# EAGLE design UsbThumb_v1 (EAGLE 5.07)
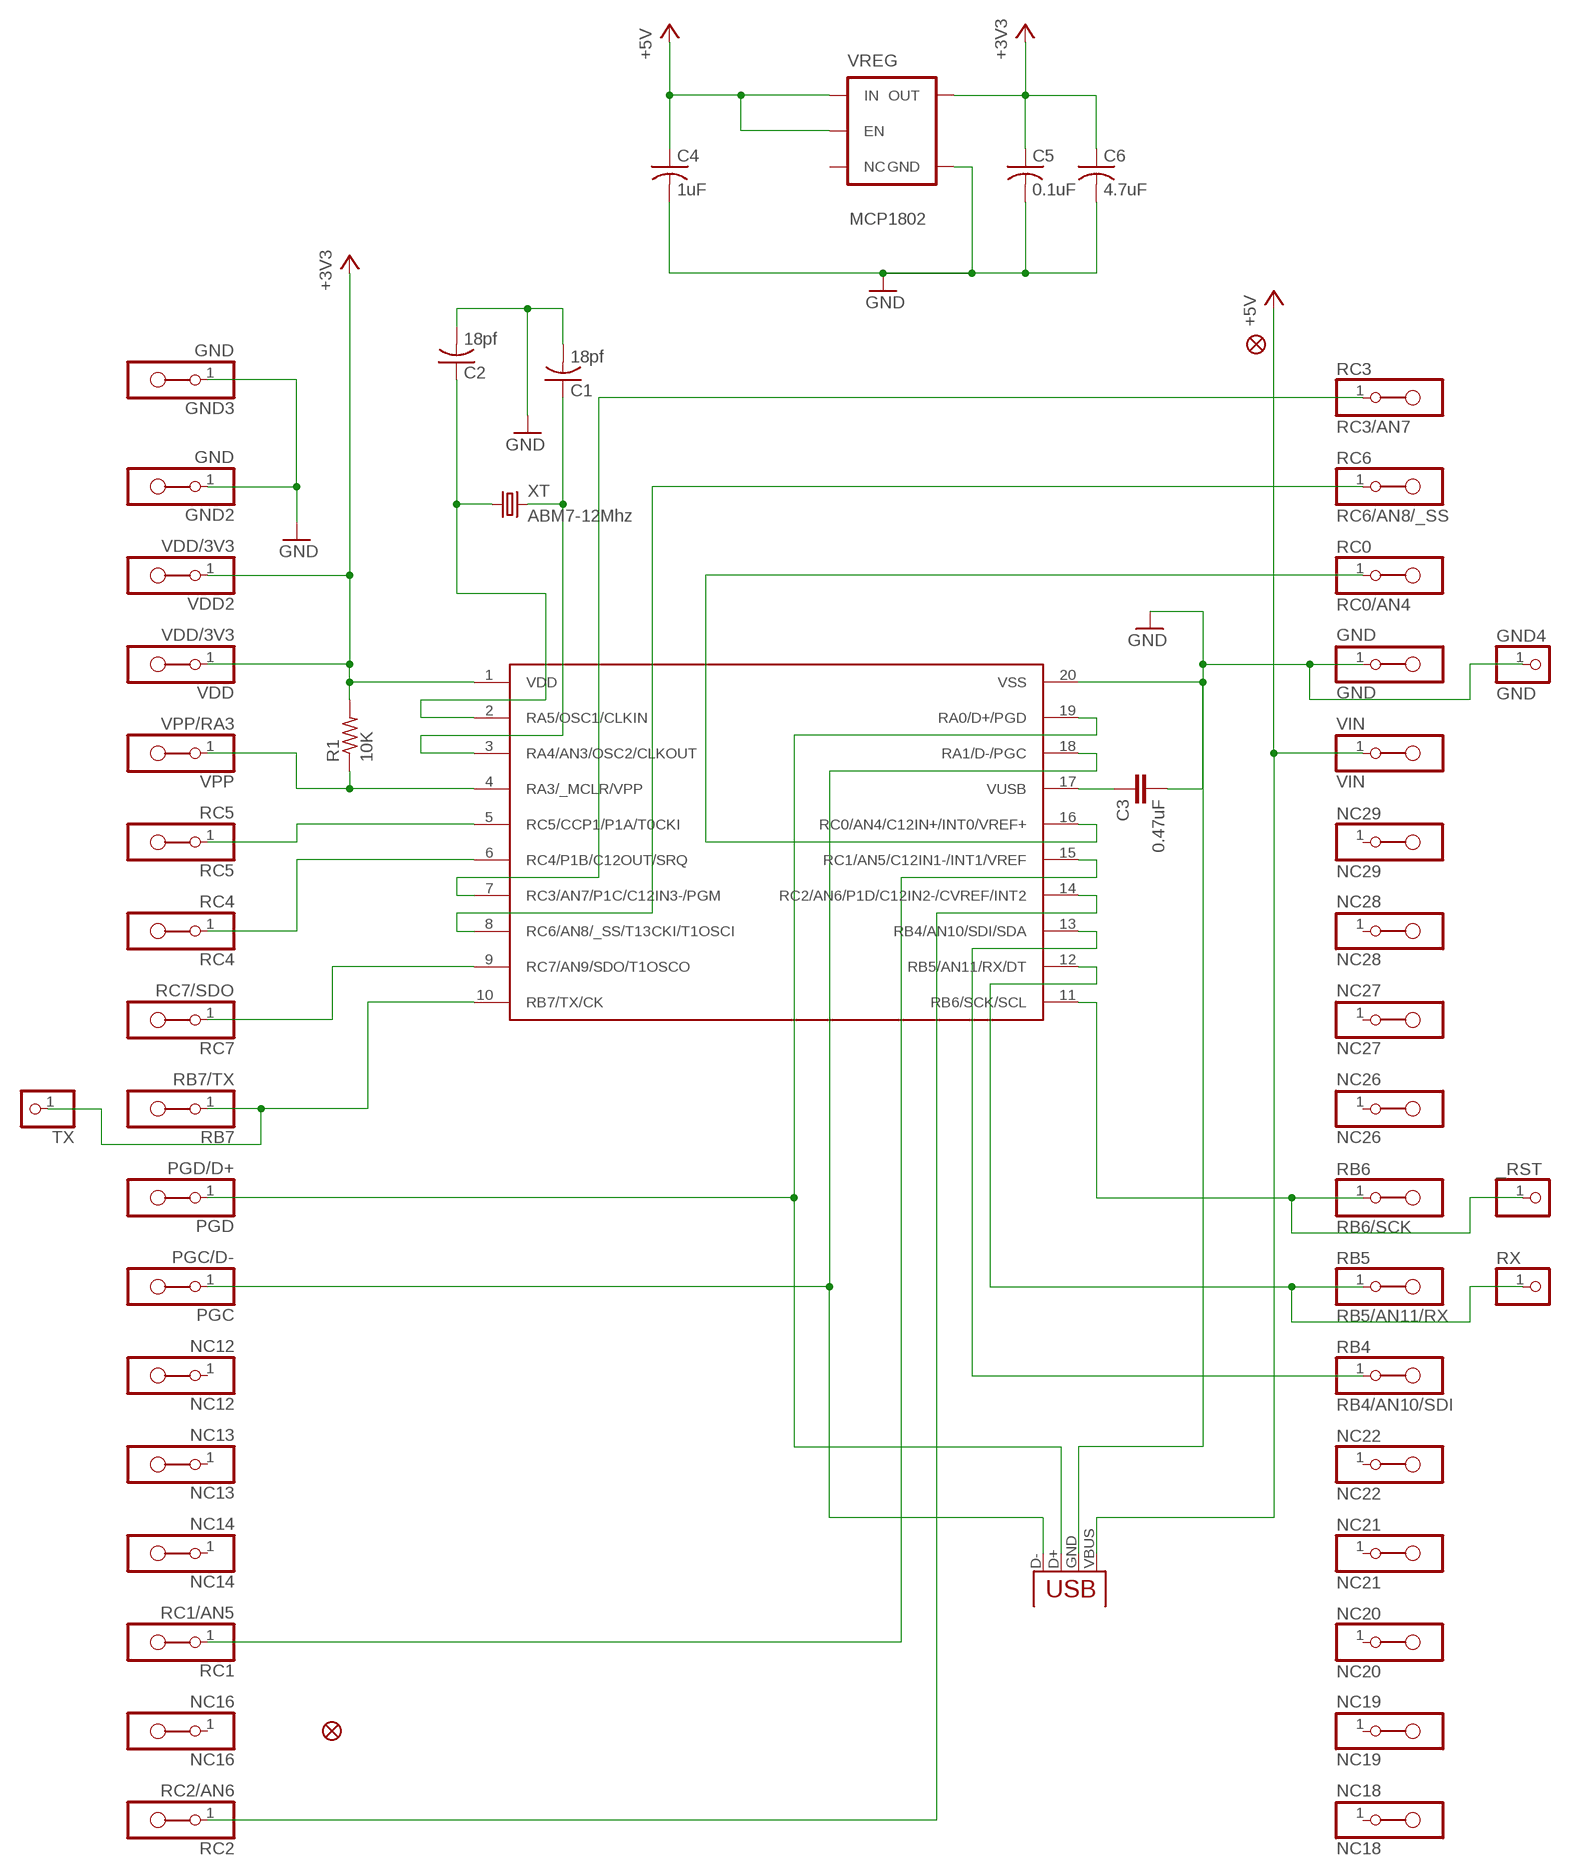
[diagram p0: schematic, sheet 1]

## Parts
_RST  PINHD-1X1  [1X01]
C1  18pf  C-USC0805  [C0805]
C2  18pf  C-USC0805  [C0805]
C3  0.47uF  C-EUC0805  [C0805]
C4  1uF  C-USC0805  [C0805]
C5  0.1uF  C-USC0805  [C0805]
C6  4.7uF  C-USC3216  [C3216]
F1  FIDUCIAL  [FIDUCIAL_1_3]
F2  FIDUCIAL  [FIDUCIAL_1_3]
GND  GND  PINHD-DOUBLECUSTOM1  [PINHD-DOUBLE-CUSTOM1]
GND2  GND  PINHD-DOUBLECUSTOM2  [PINHD-DOUBLE-CUSTOM2]
GND3  GND  PINHD-DOUBLECUSTOM2  [PINHD-DOUBLE-CUSTOM2]
GND4  GND  PINHD-1X1  [1X01]
NC12  NC12  PINHD-DOUBLECUSTOM2  [PINHD-DOUBLE-CUSTOM2]
NC13  NC13  PINHD-DOUBLECUSTOM2  [PINHD-DOUBLE-CUSTOM2]
NC14  NC14  PINHD-DOUBLECUSTOM2  [PINHD-DOUBLE-CUSTOM2]
NC16  NC16  PINHD-DOUBLECUSTOM2  [PINHD-DOUBLE-CUSTOM2]
NC18  NC18  PINHD-DOUBLECUSTOM1  [PINHD-DOUBLE-CUSTOM1]
NC19  NC19  PINHD-DOUBLECUSTOM1  [PINHD-DOUBLE-CUSTOM1]
NC20  NC20  PINHD-DOUBLECUSTOM1  [PINHD-DOUBLE-CUSTOM1]
NC21  NC21  PINHD-DOUBLECUSTOM1  [PINHD-DOUBLE-CUSTOM1]
NC22  NC22  PINHD-DOUBLECUSTOM1  [PINHD-DOUBLE-CUSTOM1]
NC26  NC26  PINHD-DOUBLECUSTOM1  [PINHD-DOUBLE-CUSTOM1]
NC27  NC27  PINHD-DOUBLECUSTOM1  [PINHD-DOUBLE-CUSTOM1]
NC28  NC28  PINHD-DOUBLECUSTOM1  [PINHD-DOUBLE-CUSTOM1]
NC29  NC29  PINHD-DOUBLECUSTOM1  [PINHD-DOUBLE-CUSTOM1]
PGC  PGC/D-  PINHD-DOUBLECUSTOM2  [PINHD-DOUBLE-CUSTOM2]
PGD  PGD/D+  PINHD-DOUBLECUSTOM2  [PINHD-DOUBLE-CUSTOM2]
PIC  PIC18XF1XK50  [SO-20W]
R1  10K  R-US_M0805  [M0805]
RB4  RB4/AN10/SDI  PINHD-DOUBLECUSTOM1  [PINHD-DOUBLE-CUSTOM1]
RB5  RB5/AN11/RX  PINHD-DOUBLECUSTOM1  [PINHD-DOUBLE-CUSTOM1]
RB6  RB6/SCK  PINHD-DOUBLECUSTOM1  [PINHD-DOUBLE-CUSTOM1]
RB7  RB7/TX  PINHD-DOUBLECUSTOM2  [PINHD-DOUBLE-CUSTOM2]
RC0  RC0/AN4  PINHD-DOUBLECUSTOM1  [PINHD-DOUBLE-CUSTOM1]
RC1  RC1/AN5  PINHD-DOUBLECUSTOM2  [PINHD-DOUBLE-CUSTOM2]
RC2  RC2/AN6  PINHD-DOUBLECUSTOM2  [PINHD-DOUBLE-CUSTOM2]
RC3  RC3/AN7  PINHD-DOUBLECUSTOM1  [PINHD-DOUBLE-CUSTOM1]
RC4  RC4  PINHD-DOUBLECUSTOM2  [PINHD-DOUBLE-CUSTOM2]
RC5  RC5  PINHD-DOUBLECUSTOM2  [PINHD-DOUBLE-CUSTOM2]
RC6  RC6/AN8/_SS  PINHD-DOUBLECUSTOM1  [PINHD-DOUBLE-CUSTOM1]
RC7  RC7/SDO  PINHD-DOUBLECUSTOM2  [PINHD-DOUBLE-CUSTOM2]
RX  PINHD-1X1  [1X01]
TX  PINHD-1X1  [1X01]
USB-A  USB-A-H  [USB-A-H]
VDD  VDD/3V3  PINHD-DOUBLECUSTOM2  [PINHD-DOUBLE-CUSTOM2]
VDD2  VDD/3V3  PINHD-DOUBLECUSTOM2  [PINHD-DOUBLE-CUSTOM2]
VIN  VIN  PINHD-DOUBLECUSTOM1  [PINHD-DOUBLE-CUSTOM1]
VPP  VPP/RA3  PINHD-DOUBLECUSTOM2  [PINHD-DOUBLE-CUSTOM2]
VREG  MCP1802  V_REG_TPS76433SOT23-5  [SOT23-5]
XT  ABM7-12Mhz  ABM7  [ABM7]

## Nets
+3V3: C5.1 C6.1 PIC.1(VDD) R1.2 VDD2.1 VDD.1 VREG.5(OUT)
+5V: C4.1 USB-A.VBUS(GND) VIN.1 VREG.1(IN) VREG.3(EN)
GND: C1.2 C2.2 C3.2 C4.2 C5.2 C6.2 GND2.1 GND3.1 GND4.1 GND.1 PIC.20(VSS) USB-A.GND(VBUS) VREG.2(GND)
N$1: C1.1 PIC.3(RA4/AN3/OSC2/CLKOUT) XT.2
N$4: PGC.1 PIC.18(RA1/D-/PGC) USB-A.D-(D+)
N$6: PGD.1 PIC.19(RA0/D+/PGD) USB-A.D+(D-)
N$7: PIC.10(RB7/TX/CK) RB7.1 TX.1
N$11: PIC.9(RC7/AN9/SDO/T1OSCO) RC7.1
N$12: C2.1 PIC.2(RA5/OSC1/CLKIN) XT.1
N$13: PIC.6(RC4/P1B/C12OUT/SRQ) RC4.1
N$14: PIC.5(RC5/CCP1/P1A/T0CKI) RC5.1
N$16: C3.1 PIC.17(VUSB)
N$19: PIC.12(RB5/AN11/RX/DT) RB5.1 RX.1
P7: PIC.7(RC3/AN7/P1C/C12IN3-/PGM) RC3.1
P8: PIC.8(RC6/AN8/_SS/T13CKI/T1OSCI) RC6.1
P11: _RST.1 PIC.11(RB6/SCK/SCL) RB6.1
P13: PIC.13(RB4/AN10/SDI/SDA) RB4.1
P14: PIC.14(RC2/AN6/P1D/C12IN2-/CVREF/INT2) RC2.1
P15: PIC.15(RC1/AN5/C12IN1-/INT1/VREF) RC1.1
P16: PIC.16(RC0/AN4/C12IN+/INT0/VREF+) RC0.1
VPP: PIC.4(RA3/_MCLR/VPP) R1.1 VPP.1
Unconnected: NC12.1 NC13.1 NC14.1 NC16.1 NC18.1 NC19.1 NC20.1 NC21.1 NC22.1 NC26.1 NC27.1 NC28.1 NC29.1 VREG.4(NC)

## Library data of the parts
_RST GND4 RX TX = pinhead:PINHD-1X1: PIN HEADER
C1 C2 C4 C5 = resistor:C-US: CAPACITOR, American symbol
C3 = rcl:C-EU: CAPACITOR, European symbol
C6 = rcl:C-US: CAPACITOR, American symbol
F1 F2 = fiducials:FIDUCIAL: Fiducial Alignment Point for machine vision alignment.
GND GND2 GND3 NC12-NC14 NC16 NC18-NC22 NC26-NC29 PGC PGD RB4-RB7 RC0 RC1-RC7 VDD VDD2 VIN VPP = starlino:PINHD-DOUBLE: Pinhead with two connected pads
PIC = microchip-pic18XF1XK50:PIC18XF1XK50: PIC18F13K50/14K50 PIC18LF13K50/14K50
R1 = resistor:R-US_: RESISTOR, American symbol
USB-A = SparkFun:USB: USB Connectors USB-B-PTH is fully proven SKU : PRT-00139 USB-miniB is fully proven SKU : PRT-00587 USB-A-PCB is untested. USB-A-H is throughly reviewed, but untested. Spark Fun Electronics SKU : PRT-00437 USB-B-SMT is throughly reviewed, but untested. Needs silkscreen touching up. USB-A-S has not been used/tested USB-MB-H has not been used/tested
VREG = SparkFun:V_REG_TPS76433: Voltage Regulator Older TI part. LDO 150mA regulator. No output by-pass cap option. See V_REG_LDO for a better part.
XT = crystals-misc:ABM7: ABM7 CERAMIC SMD MICRO MINIATURE MICROPROCESSOR CRYSTAL

## Board
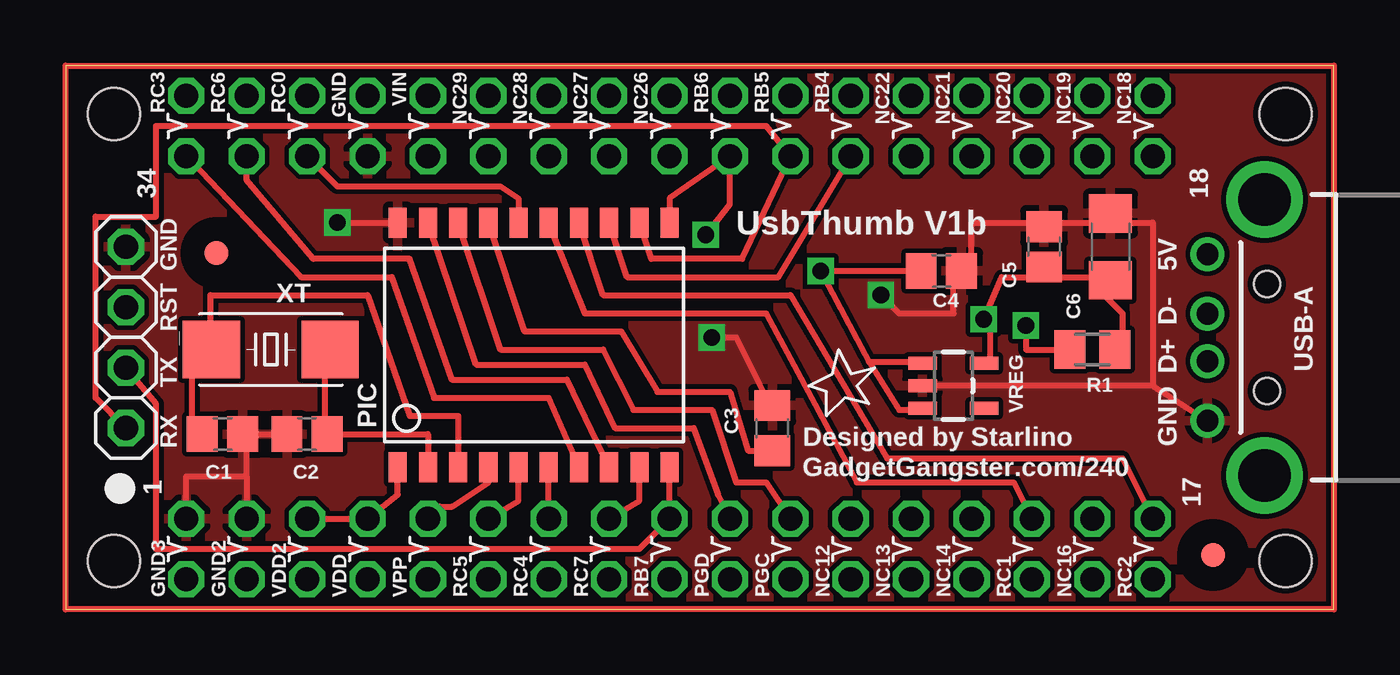
[diagram p1: board, top side]
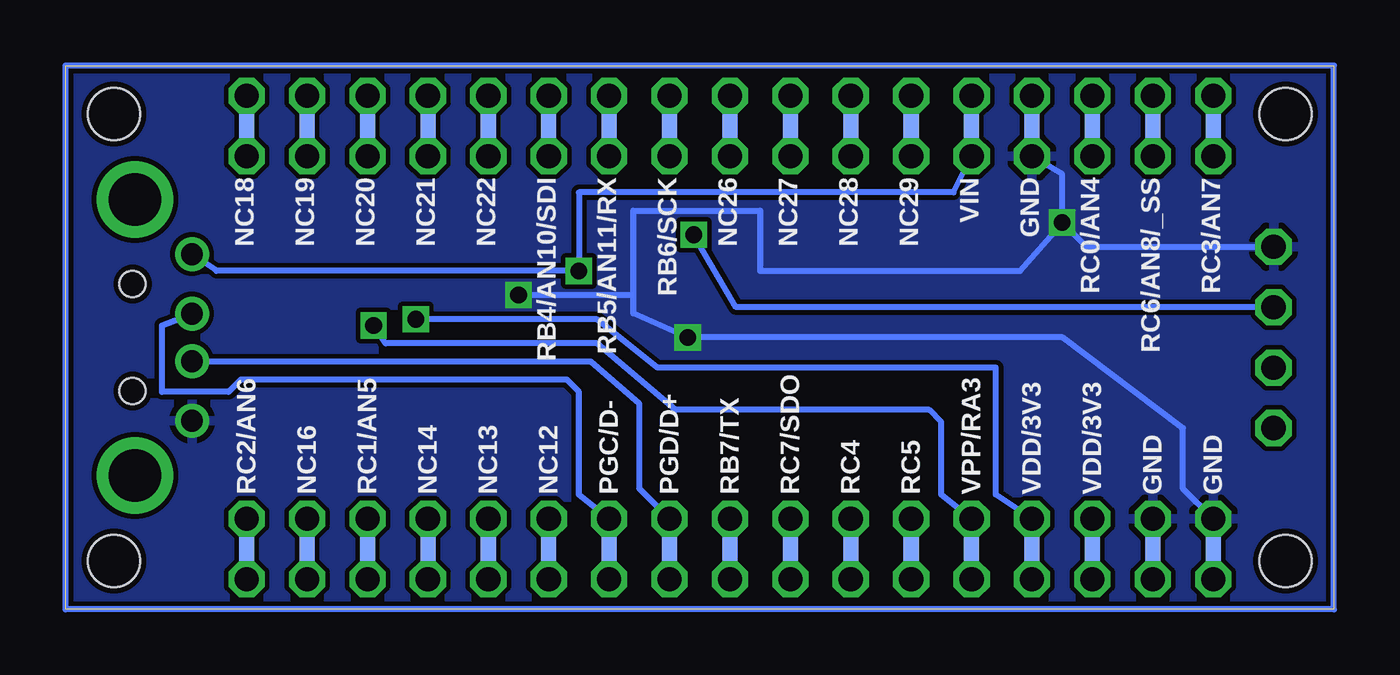
[diagram p2: board, bottom side, seen from below]

Size 53.34 x 22.86 mm. Coordinates in mm from the lower left corner, seen from the top.
Outline: 0,0 53.34,0 53.34,22.86 0,22.86 0,0
Copper layers (1*16): Top 0.035mm / dielectric 1.5mm / Bottom 0.035mm
Design rules "default *": minimum track width 8mil, minimum drill 24mil, track to track 8mil, track to pad 8mil, pad to pad 8mil, via to via 8mil, smd to smd 8mil, copper to edge 10mil, drill to drill 8mil, minimum pad ring 10mil, minimum via ring 8mil, stop-mask expansion 4mil, vias tented up to drill 0mil, thermal gap 10mil
Holes 2.2 mm at 51.31,20.83 51.31,2.03 2.03,20.83 2.03,2.03

### Footprints (pad centres in the part's own frame; a part is rotated, then mirrored left to right if it is on the bottom)
1X01 = drill 1.016 octagon: 1 0,0
C0805 = smd 1.3 x 1.5: 1 -0.85,0; 2 0.85,0
C0805' = smd 1.3 x 1.5: 1 -0.95,0; 2 0.95,0
C3216 = smd 1.6 x 1.8: 1 -1.4,0; 2 1.4,0
FIDUCIAL_1_3 = smd 1 x 1: 1 0,0
PINHD-DOUBLE-CUSTOM1 = drill 1.016 octagon: 1 -1.27,0; 2 1.27,0 | smd 1.27 x 0.635 bottom: P$1 0,0
PINHD-DOUBLE-CUSTOM2 = drill 1.016 octagon: 1 -1.27,0; 2 1.27,0 | smd 1.27 x 0.635 bottom: P$1 0,0
SO-20W = smd 0.762 x 1.27: 1 -5.08,-5.207; 2 -3.81,-5.207; 3 -2.54,-5.207; 4 -1.27,-5.207; 5 0,-5.207; 6 1.27,-5.207; 7 2.54,-5.207; 8 3.81,-5.207; 9 5.08,-5.207; 10 6.35,-5.207; 11 6.35,5.08; 12 5.08,5.08; 13 3.81,5.08; 14 2.54,5.08; 15 1.27,5.08; 16 0,5.08; 17 -1.27,5.08; 18 -2.54,5.08; 19 -3.81,5.08; 20 -5.08,5.08
M0805 = smd 1.3 x 1.6: 1 -0.95,0; 2 0.95,0
USB-A-H = drill 0.914 round: D+ 2.4,1; D- 2.4,-1; GND 2.4,3.5; VBUS 2.4,-3.5 | drill 2.2 round: GND@1 0,5.8; GND@2 0,-5.8 | hole 1.1: -0.1,2.25; -0.1,-2.25
SOT23-5 = smd 0.55 x 1.2: 1 -0.95,-1.3; 2 0,-1.3; 3 0.95,-1.3; 4 0.95,1.3; 5 -0.95,1.3
ABM7 = smd 2.4 x 2.4: 1 -2.5,0; 2 2.5,0

### Placement (x,y rotation side)
_RST  2.54,12.7 0 top
C1  6.6,7.37 0 top
C2  10.16,7.37 180 top
C3  0.47uF  [C0805']  29.72,7.62 90 top
C4  36.83,14.22 0 top
C5  41.15,15.24 90 top
C6  43.94,15.24 90 top
F1  6.35,14.99 0 top
F2  48.26,2.29 0 top
GND  12.7,20.32 90 top
GND2  7.62,2.54 270 top
GND3  5.08,2.54 270 top
GND4  2.54,15.24 0 top
NC12  33.02,2.54 270 top
NC13  35.56,2.54 270 top
NC14  38.1,2.54 270 top
NC16  43.18,2.54 270 top
NC18  45.72,20.32 90 top
NC19  43.18,20.32 90 top
NC20  40.64,20.32 90 top
NC21  38.1,20.32 90 top
NC22  35.56,20.32 90 top
NC26  25.4,20.32 90 top
NC27  22.86,20.32 90 top
NC28  20.32,20.32 90 top
NC29  17.78,20.32 90 top
PGC  30.48,2.54 270 top
PGD  27.94,2.54 270 top
PIC  19.05,11.18 0 top
R1  43.18,10.92 0 top
RB4  33.02,20.32 90 top
RB5  30.48,20.32 90 top
RB6  27.94,20.32 90 top
RB7  25.4,2.54 270 top
RC0  10.16,20.32 90 top
RC1  40.64,2.54 270 top
RC2  45.72,2.54 270 top
RC3  5.08,20.32 90 top
RC4  20.32,2.54 270 top
RC5  17.78,2.54 270 top
RC6  7.62,20.32 90 top
RC7  22.86,2.54 270 top
RX  2.54,7.62 0 top
TX  2.54,10.16 0 top
USB-A  50.42,11.43 180 top
VDD  12.7,2.54 270 top
VDD2  10.16,2.54 270 top
VIN  15.24,20.32 90 top
VPP  15.24,2.54 270 top
VREG  37.34,9.4 270 top
XT  8.64,10.92 180 top

### Tracks (layer width: path | path; a pad name or v marks a point on that pad's centre or on a via)
+3V3  (via drill 0.7)
  Top 0.254: PIC.1 13.97,4.83 VDD.1 VDD2.1 | VREG.5 38.86,10.41 38.86,11.94 v38.61,12.19 39.37,13.97 40.89,13.97 C5.1 41.66,13.97 43.94,13.97 C6.1 43.43,13.46 44.45,12.45 44.45,11.43 R1.2
  Bottom 0.254: VDD.1 14.22,4.83 14.22,10.16 28.45,10.16 30.99,12.19 v38.61,12.19
+5V  (via drill 0.7)
  Top 0.254: C4.1 v31.75,14.22 33.78,10.41 | 33.78,10.41 36.32,10.41 VREG.1 | VREG.3 36.32,8.38 35.05,8.38 33.78,10.41
  Bottom 0.254: VIN.1 16,17.53 31.75,17.53 v31.75,14.22 46.99,14.22 USB-A.VBUS
GND  (via drill 0.7)
  Top 0.254: v27.18,11.43 28.19,11.43 29.46,8.89 C3.2 | 40.89,16.26 43.43,16.26 | 43.43,16.26 C6.2 | 43.43,16.26 45.72,16.26 45.72,9.4 | 45.72,9.4 VREG.2 | 40.89,16.26 C5.2 | 40.89,16.26 38.1,16.26 38.1,14.48 C4.2 37.34,13.97 37.34,12.45 35.05,12.45 v34.29,13.21 | C2.2 C1.2 7.62,7.11 7.62,5.59 | 7.62,5.59 5.08,5.59 GND3.1 | 7.62,5.59 GND2.1 | 45.72,9.4 USB-A.GND | v11.43,16.26 PIC.20
  Bottom 0.254: GND3.1 6.35,5.08 6.35,7.62 11.43,11.43 v27.18,11.43 29.46,12.45 29.46,13.21 | 29.46,13.21 v34.29,13.21 | v11.43,16.26 11.43,18.29 GND.1 | v11.43,16.26 13.21,14.22 24.13,14.22 24.13,16.76 29.46,16.76 29.46,13.21 | GND4.1 10.41,15.24 v11.43,16.26
  pour Bottom: 0,22.86 0,0 53.34,0 53.34,22.86
  pour Top: 0,22.86 0,0 53.34,0 53.34,22.86
N$1
  Top 0.254: PIC.3 16.51,8.13 14.48,8.13 12.7,13.21 6.1,13.21 6.1,11.68 XT.2 5.33,10.16 5.33,7.87 C1.1
N$2
  Bottom 0.254: 0,22.86 53.34,22.86 53.34,0 0,0 0,22.86
N$4
  Top 0.254: PIC.18 18.29,10.92 22.61,10.92 23.88,8.38 27.18,8.38 28.19,5.33 29.46,5.33 PGC.1
  Bottom 0.254: PGC.1 31.75,4.83 31.75,9.14 32.26,9.65 45.97,9.65 46.48,9.14 49.28,9.14 49.28,11.94 USB-A.D-
N$6
  Top 0.254: PIC.19 17.27,10.29 21.84,10.29 23.11,7.62 26.42,7.62 27.43,4.83 PGD.1
  Bottom 0.254: PGD.1 29.21,5.08 29.21,8.64 31.24,10.41 47.75,10.41 USB-A.D+
N$7
  Top 0.254: PIC.10 RB7.1 24.13,2.54 3.81,2.54 3.81,8.64 TX.1
N$8
  Top 0.254: 0,22.86 53.34,22.86 53.34,0 0,0 0,22.86
N$11
  Top 0.254: PIC.9 24.13,4.57 RC7.1
N$12
  Top 0.254: XT.1 10.92,9.91 10.92,7.87 C2.1 15.24,7.37 PIC.2
N$13
  Top 0.254: RC4.1 PIC.6
N$14
  Top 0.254: PIC.5 19.05,4.57 RC5.1
N$16
  Top 0.254: PIC.17 19.3,11.68 23.37,11.68 24.89,9.14 27.94,9.14 28.7,6.67 C3.1
N$19
  Top 0.254: PIC.12 24.64,14.73 28.45,14.73 RB5.1 29.46,20.32 3.81,20.32 3.81,16.51 1.27,16.51 1.27,8.89 RX.1
P7
  Top 0.254: PIC.7 20.32,8.89 15.49,8.89 13.72,13.97 9.91,13.97 5.33,18.8 RC3.1
P8
  Top 0.254: RC6.1 7.62,18.03 10.41,14.73 14.48,14.73 16.26,9.65 21.08,9.65 PIC.8
P11  (via drill 0.7)
  Top 0.254: PIC.11 25.4,17.27 RB6.1 27.94,17.02 v26.92,15.75
  Bottom 0.254: _RST.1 25.15,12.7 v26.92,15.75
P13
  Top 0.254: PIC.13 23.62,13.97 29.97,13.97 RB4.1
P14
  Top 0.254: PIC.14 22.61,13.21 30.48,13.21 34.54,6.35 44.45,6.35 RC2.1
P15
  Top 0.254: PIC.15 21.84,12.45 29.46,12.45 33.27,5.33 39.88,5.33 RC1.1
P16
  Top 0.254: RC0.1 11.43,17.78 18.29,17.78 19.05,17.27 PIC.16
VPP  (via drill 0.7)
  Top 0.254: PIC.4 17.78,5.33 16.26,4.32 15.75,4.32 VPP.1 | R1.1 40.39,10.92 v40.39,11.94
  Bottom 0.254: VPP.1 16.51,4.83 16.51,7.87 17.02,8.38 27.69,8.38 30.99,11.18 39.88,11.18 v40.39,11.94

### Text on the board
tPlace: 18 | 34 | UsbThumb V1b | Designed by Starlino | GadgetGangster.com/240 | 1 | 17
tNames: 5V | D- | D+ | GND